# Altium schematic sheet TOP.SchDoc
size A
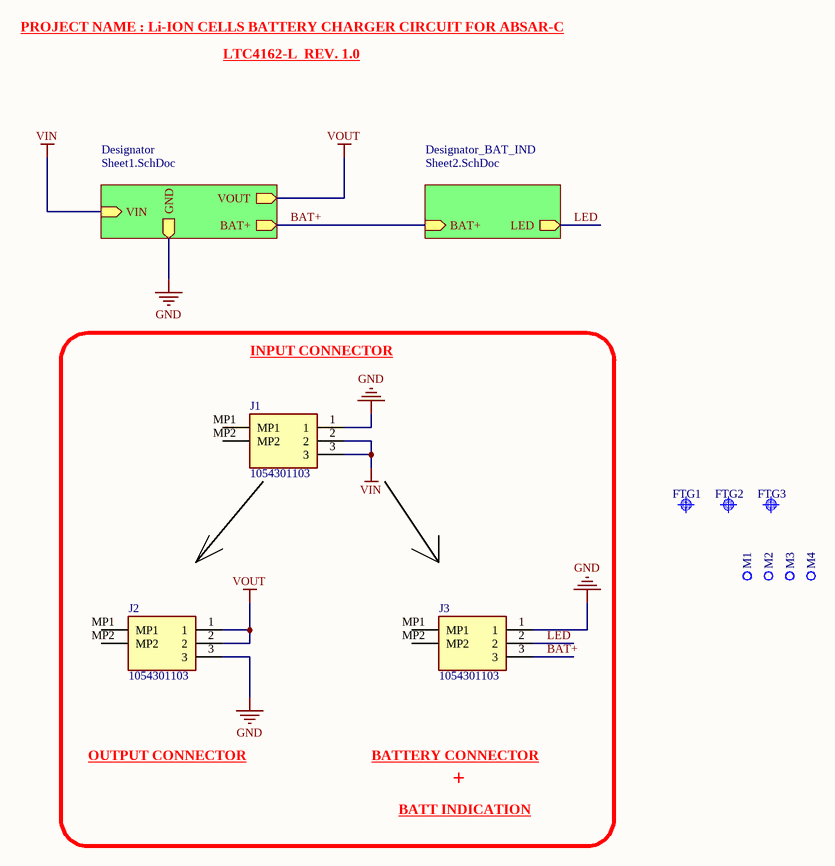
[diagram p0: TOP.SchDoc]

## Parts
FTG1  Use only in PCB  [Fudicial]  (value not drawn)
FTG2  Use only in PCB  [Fudicial]  (value not drawn)
FTG3  Use only in PCB  [Fudicial]  (value not drawn)
J1  1054301103  [1054301103]
J2  1054301103  [1054301103]
J3  1054301103  [1054301103]
M1  (no value)  [Mounting_pad]
M2  (no value)  [Mounting_pad]
M3  (no value)  [Mounting_pad]
M4  (no value)  [Mounting_pad]

## Blocks framed on the sheet
+: J1-J3

## Sub-sheets
Designator = Sheet1.SchDoc: VIN (in), VOUT (out), GND (out), BAT+ (out)
Designator_BAT_IND = Sheet2.SchDoc: BAT+ (in), LED (out)

## Nets
GND: J1.1 J2.3 J3.1 ; sheet Designator/GND
VIN: J1.2 J1.3 ; sheet Designator/VIN
VOUT: J2.1 J2.2 ; sheet Designator/VOUT
BAT+: J3.3 ; sheet Designator/BAT+, sheet Designator_BAT_IND/BAT+
LED: J3.2 ; sheet Designator_BAT_IND/LED

Not connected (* = marked no-connect by the designer): J1 MP1 MP2; J2 MP1 MP2; J3 MP1 MP2; M1 1; M2 1; M3 1; M4 1

## Notes on the sheet
- PROJECT NAME : Li-ION CELLS BATTERY CHARGER CIRCUIT FOR ABSAR-C
- LTC4162-L  REV. 1.0
- INPUT CONNECTOR
- OUTPUT CONNECTOR
- BATTERY CONNECTOR
- BATT INDICATION

## Library data of the parts
FTG1-FTG3 = Fiducial Target
J1-J3 = 1054301103: Connector; Manufacturer_Name: Molex; Datasheet Link: https://www.molex.com/pdm_docs/sd/1054301103_sd.pdf; Height: 7.19mm; Manufacturer_Part_Number: 1054301103; Mouser Part Number: N/A; Mouser Price/Stock: https://www.mouser.com/Search/Refine.aspx?Keyword=N%2FA
M1-M4 = Through Hole Pad